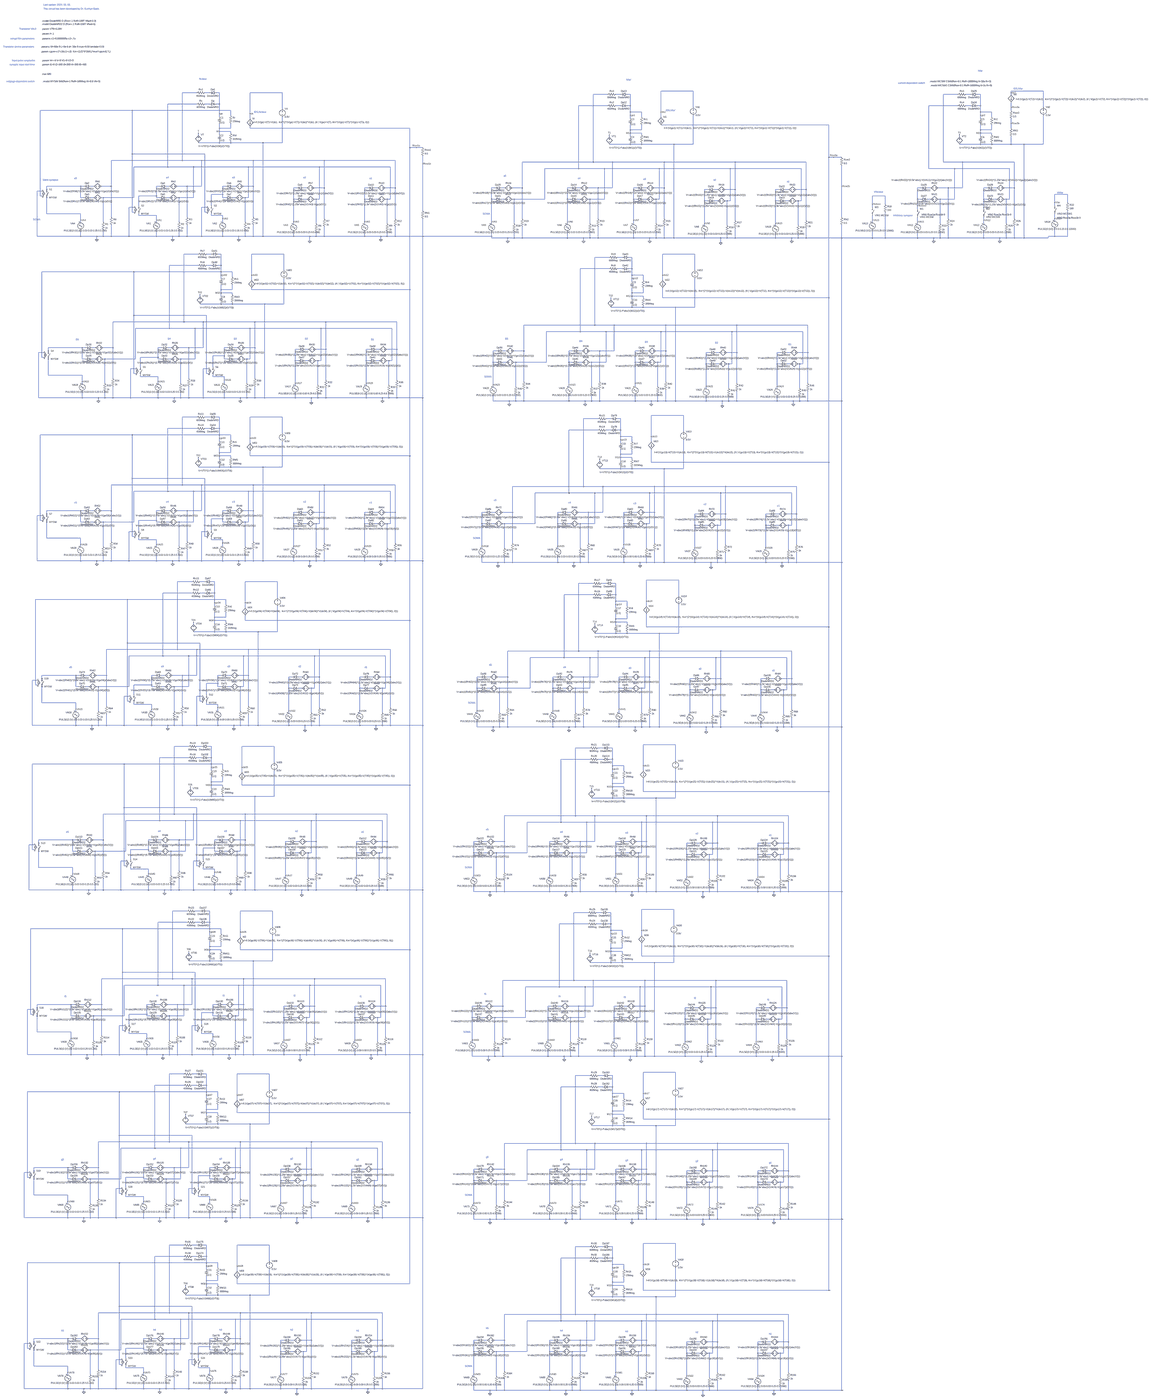
[diagram p0: schematic depth_Baek.asc, whole sheet]
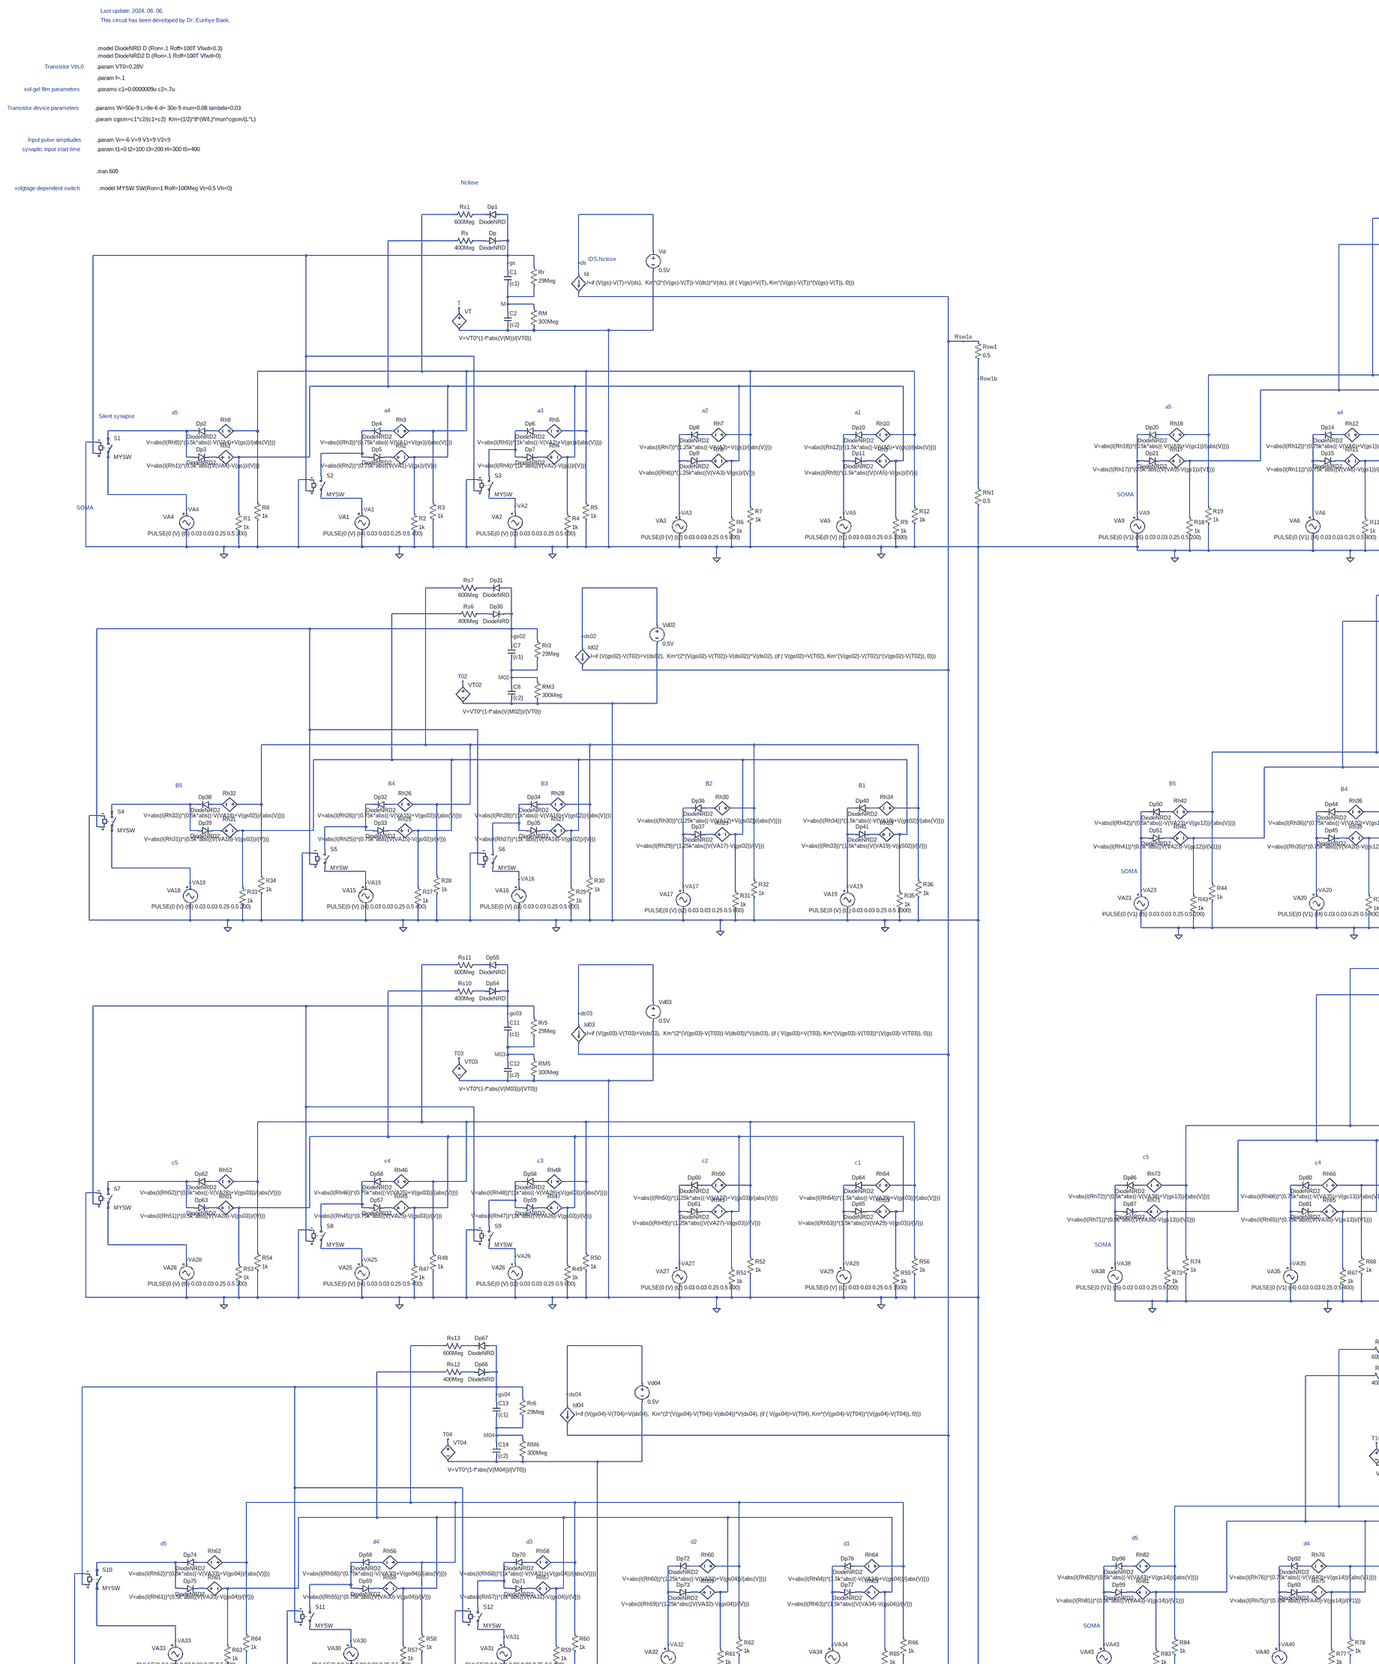
[diagram p1: schematic depth_Baek.asc, part, row 1 of 2, column 1 of 2]
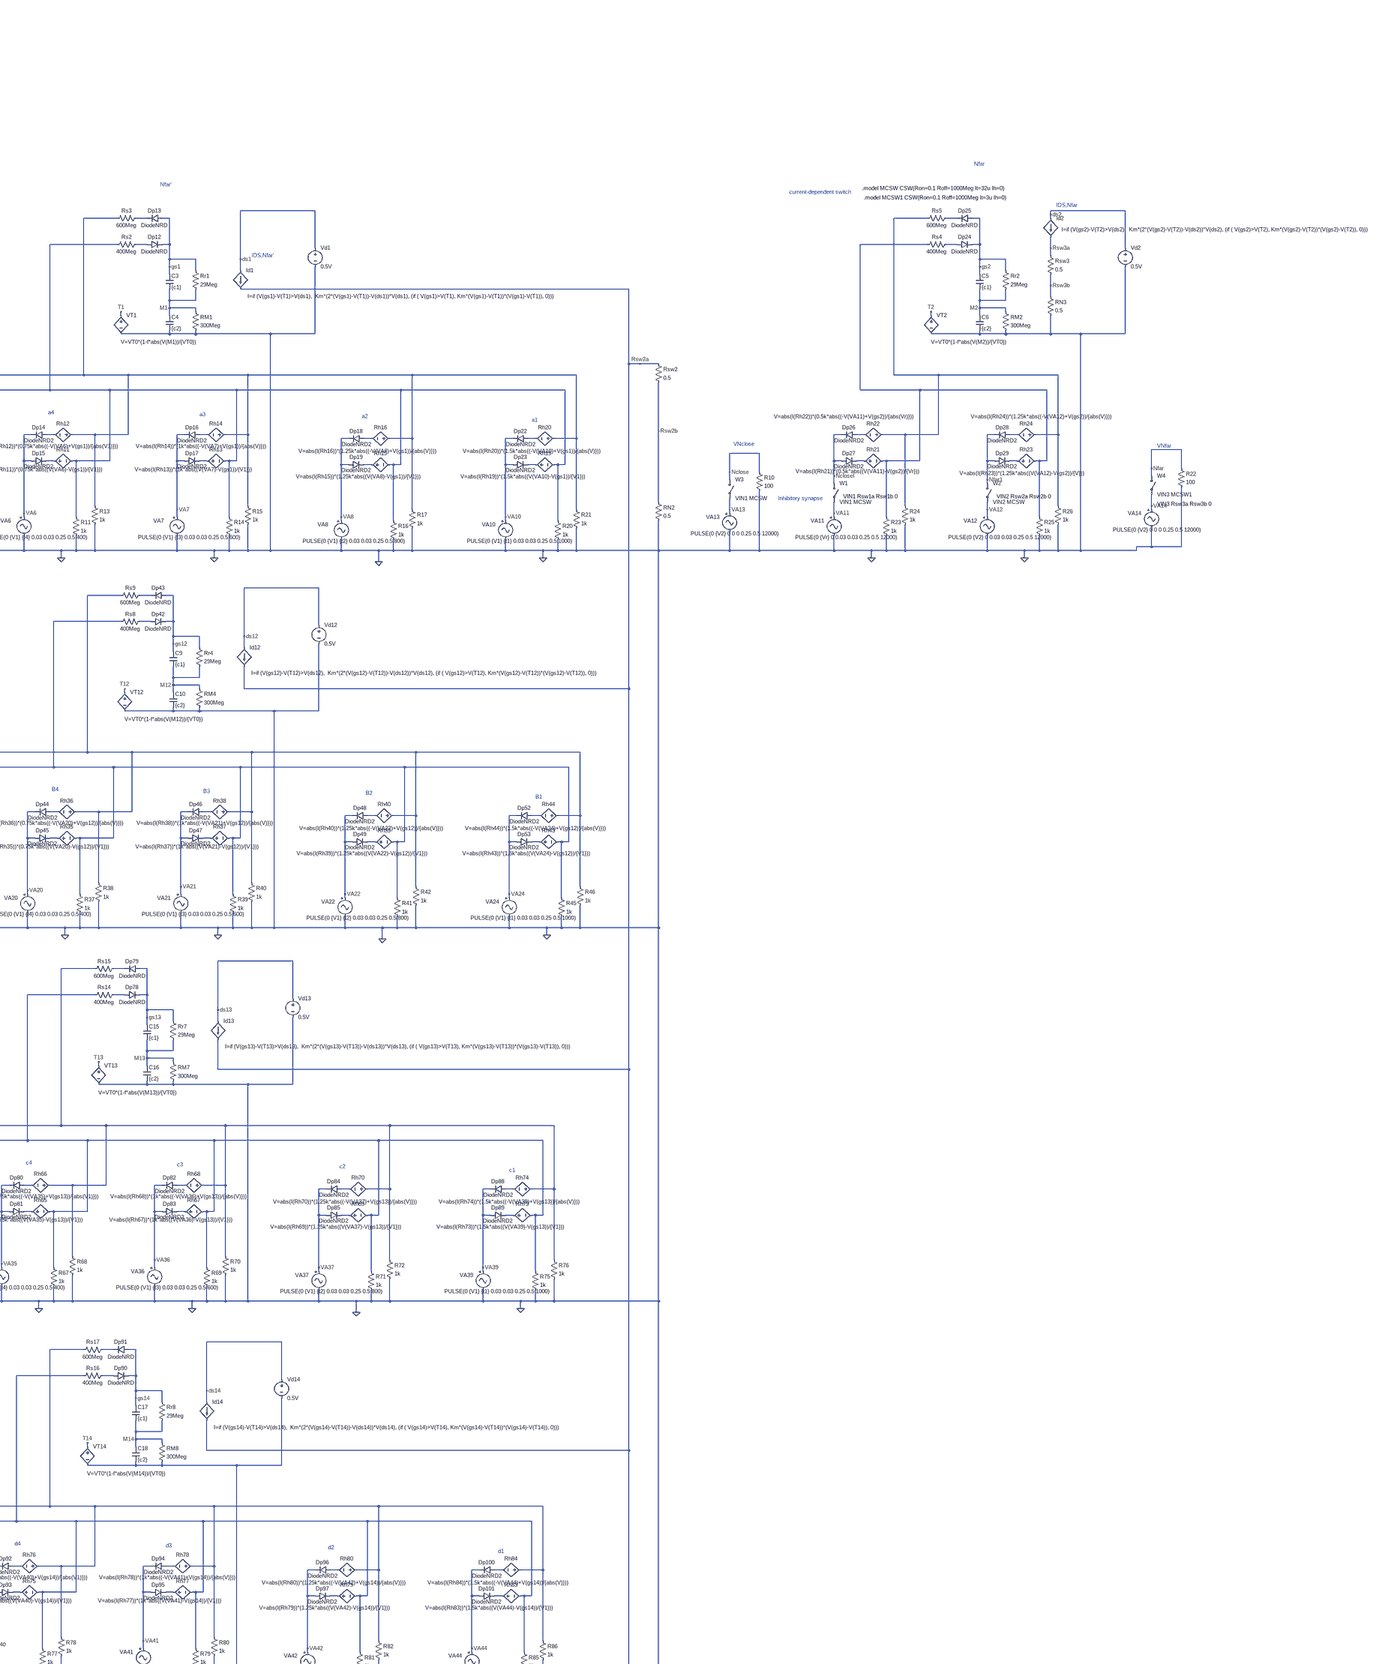
[diagram p2: schematic depth_Baek.asc, part, row 1 of 2, column 2 of 2]
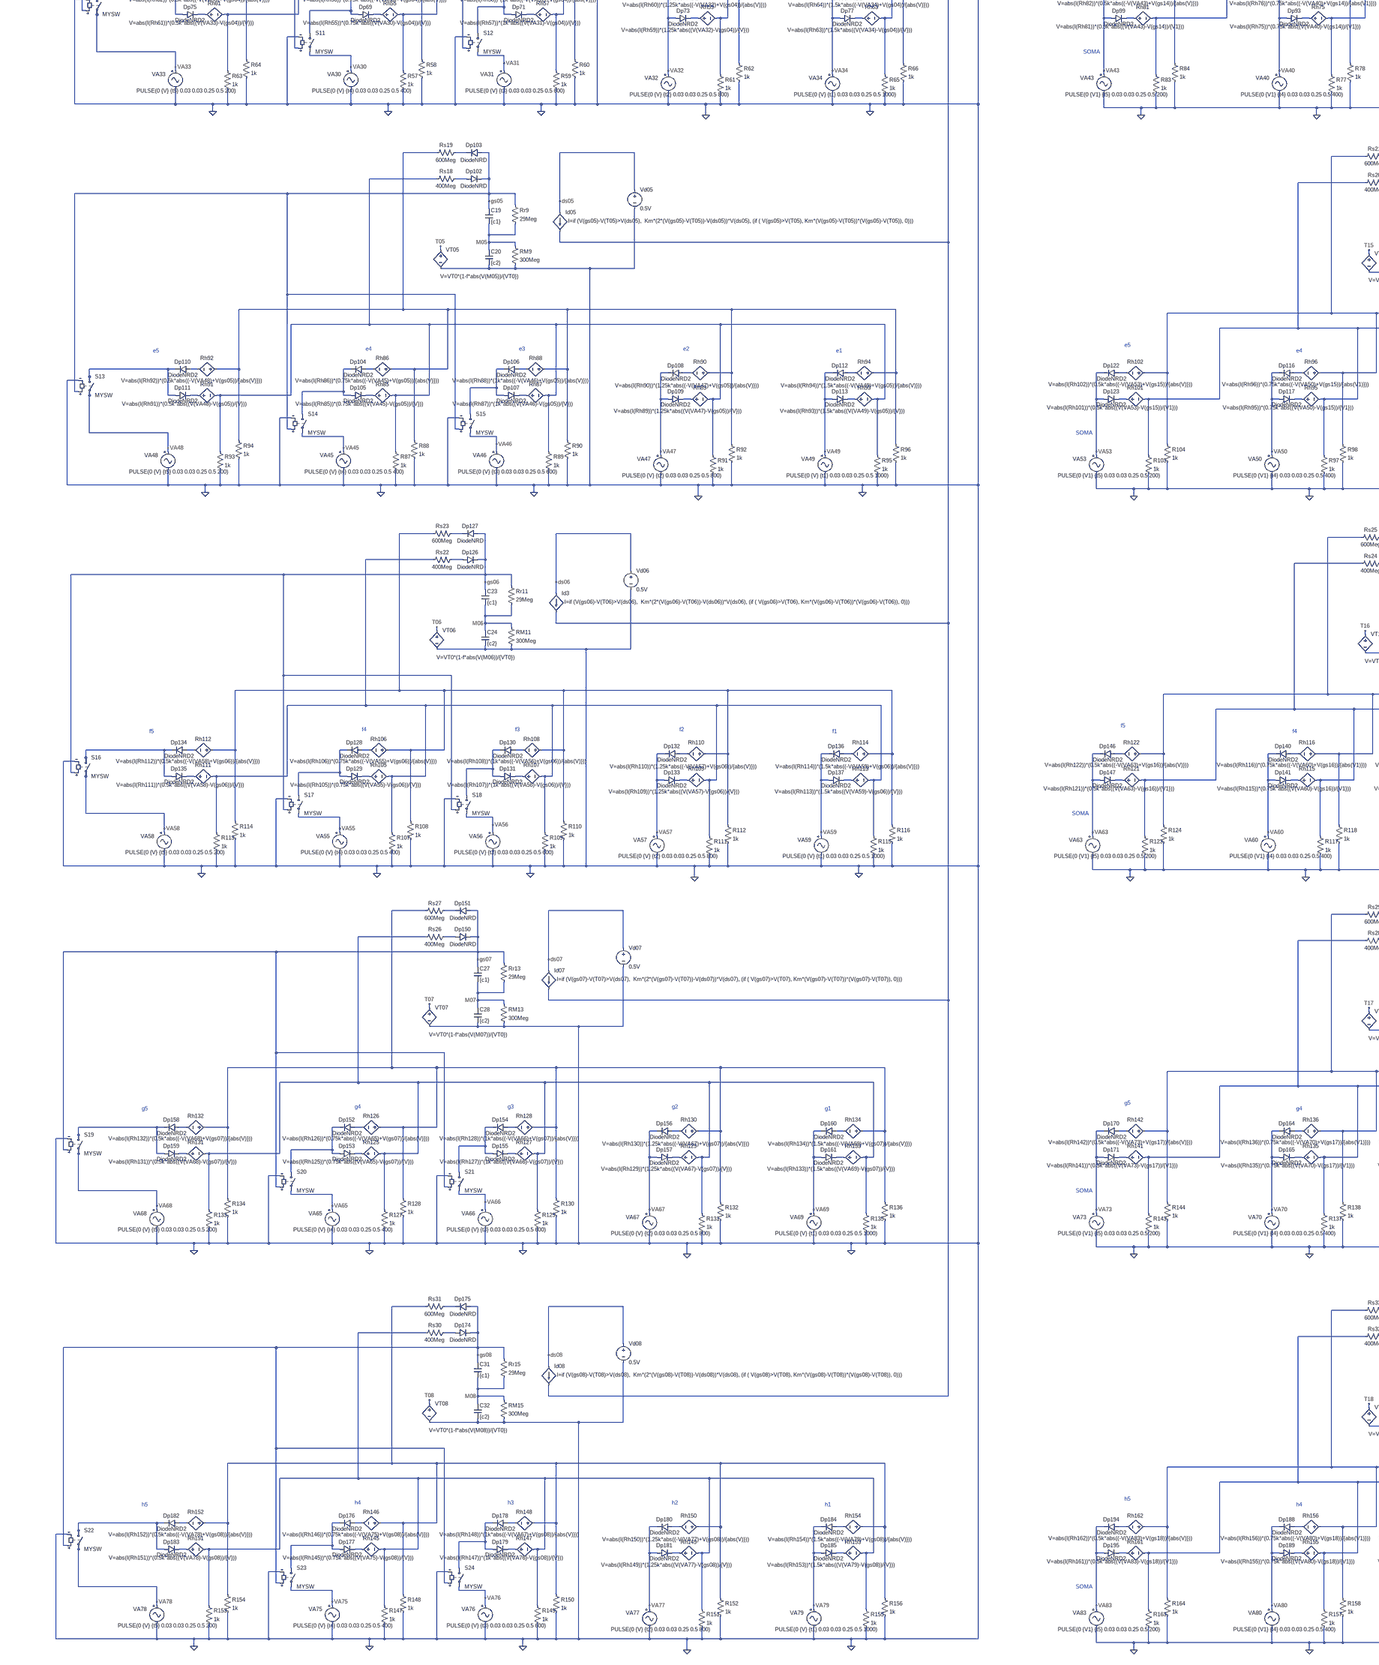
[diagram p3: schematic depth_Baek.asc, part, row 2 of 2, column 1 of 2]
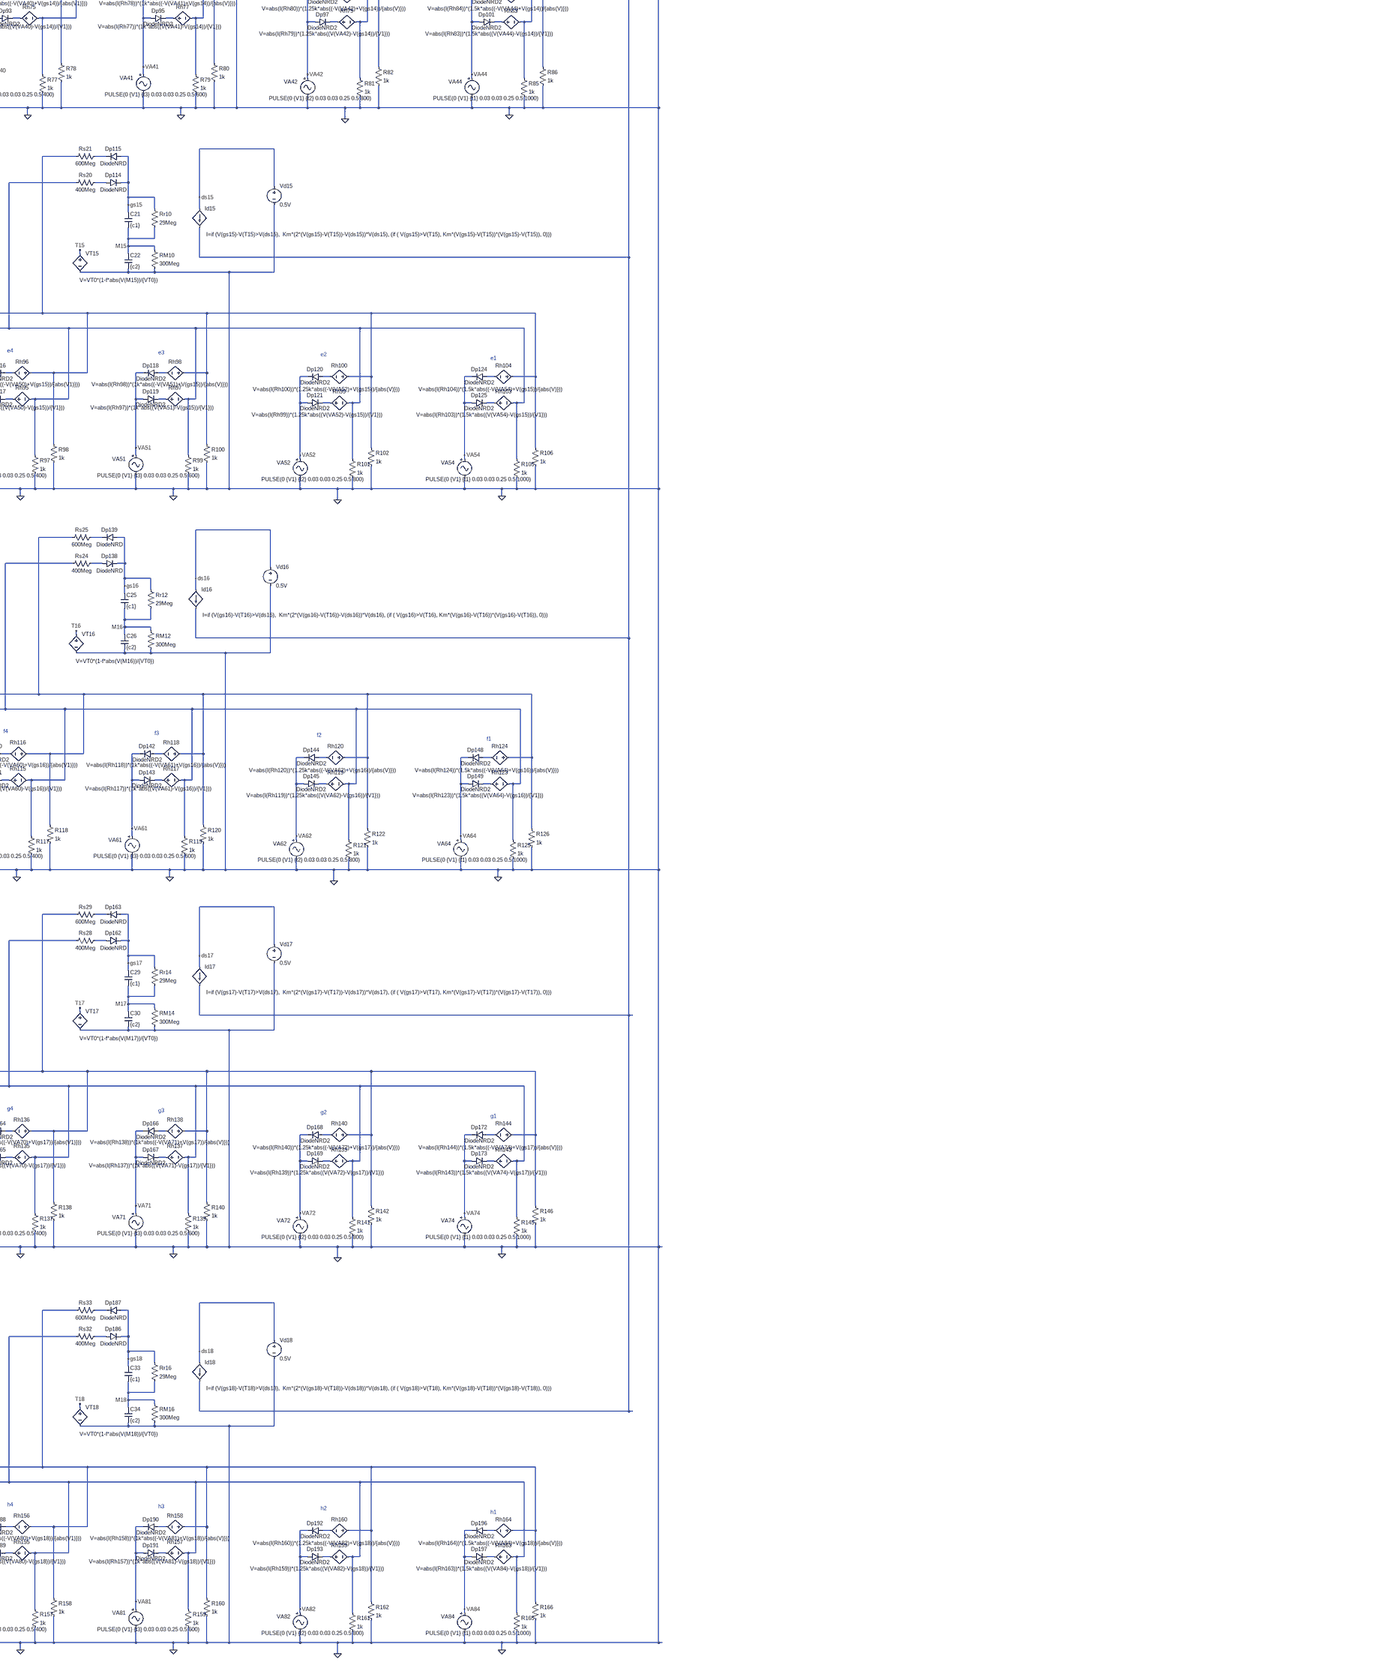
[diagram p4: schematic depth_Baek.asc, part, row 2 of 2, column 2 of 2]
* depth_Baek.asc
Vd ds 0 0.5V
B§Id ds Rsw1a I=if (V(gs)-V(T)>V(ds),  Km*(2*(V(gs)-V(T))-V(ds))*V(ds), (if ( V(gs)>V(T), Km*(V(gs)-V(T))*(V(gs)-V(T)), 0)))
C1 gs M {c1}
C2 M 0 {c2}
Dp N008 gs DiodeNRD
Rs N008 N007 400Meg
Rr gs M 29Meg
RM M 0 300Meg
B§VT T 0 V=VT0*(1-f*abs(V(M))/{VT0})
Dp1 gs N002 DiodeNRD
Rs1 N002 N001 600Meg
VA1 VA1 0 PULSE(0 {V} {t4} 0.03 0.03 0.25 0.5 400)
R2 N007 0 1k
B§Rh2 N029 N007 V=abs(I(Rh2))*(0.75k*abs((V(VA1)-V(gs))/{V}))
B§Rh3 N001 N016 V=abs(I(Rh3))*(0.75k*abs((-V(VA1)+V(gs))/{abs(V)}))
Dp4 N016 N015 DiodeNRD2
Dp5 N015 N029 DiodeNRD2
R3 N001 0 1k
VA2 VA2 0 PULSE(0 {V} {t3} 0.03 0.03 0.25 0.5 600)
R4 N007 0 1k
B§Rh4 N030 N007 V=abs(I(Rh4))*(1k*abs((V(VA2)-V(gs))/{V}))
B§Rh5 N001 N018 V=abs(I(Rh5))*(1k*abs((-V(VA2)+V(gs))/{abs(V)}))
Dp6 N018 N017 DiodeNRD2
Dp7 N017 N030 DiodeNRD2
R5 N001 0 1k
VA3 VA3 0 PULSE(0 {V} {t2} 0.03 0.03 0.25 0.5 800)
R6 N007 0 1k
B§Rh6 N031 N007 V=abs(I(Rh6))*(1.25k*abs((V(VA3)-V(gs))/{V}))
B§Rh7 N001 N019 V=abs(I(Rh7))*(1.25k*abs((-V(VA3)+V(gs))/{abs(V)}))
Dp8 N019 VA3 DiodeNRD2
Dp9 VA3 N031 DiodeNRD2
R7 N001 0 1k
VA4 VA4 0 PULSE(0 {V} {t5} 0.03 0.03 0.25 0.5 200)
R1 N007 0 1k
B§Rh1 N028 N007 V=abs(I(Rh1))*(0.5k*abs((V(VA4)-V(gs))/{V}))
B§Rh8 N001 N014 V=abs(I(Rh8))*(0.5k*abs((-V(VA4)+V(gs))/{abs(V)}))
Dp2 N014 N013 DiodeNRD2
Dp3 N013 N028 DiodeNRD2
R8 N001 0 1k
S1 N013 VA4 gs 0 MYSW
VA5 VA5 0 PULSE(0 {V} {t1} 0.03 0.03 0.25 0.5 1000)
R9 N007 0 1k
B§Rh9 N032 N007 V=abs(I(Rh9))*(1.5k*abs((V(VA5)-V(gs))/{V}))
B§Rh10 N001 N020 V=abs(I(Rh12))*(1.5k*abs((-V(VA5)+V(gs))/{abs(V)}))
Dp10 N020 VA5 DiodeNRD2
Dp11 VA5 N032 DiodeNRD2
R12 N001 0 1k
Vd1 ds1 0 0.5V
B§Id1 ds1 Rsw2a I=if (V(gs1)-V(T1)>V(ds1),  Km*(2*(V(gs1)-V(T1))-V(ds1))*V(ds1), (if ( V(gs1)>V(T1), Km*(V(gs1)-V(T1))*(V(gs1)-V(T1)), 0)))
C3 gs1 M1 {c1}
C4 M1 0 {c2}
Dp12 N010 gs1 DiodeNRD
Rs2 N010 N009 400Meg
Rr1 gs1 M1 29Meg
RM1 M1 0 300Meg
B§VT1 T1 0 V=VT0*(1-f*abs(V(M1))/{VT0})
Dp13 gs1 N004 DiodeNRD
Rs3 N004 N003 600Meg
VA6 VA6 0 PULSE(0 {V1} {t4} 0.03 0.03 0.25 0.5 400)
R11 N009 0 1k
B§Rh11 N034 N009 V=abs(I(Rh11))*(0.75k*abs((V(VA6)-V(gs1))/{V1}))
B§Rh12 N003 N022 V=abs(I(Rh12))*(0.75k*abs((-V(VA6)+V(gs1))/{abs(V1)}))
Dp14 N022 VA6 DiodeNRD2
Dp15 VA6 N034 DiodeNRD2
R13 N003 0 1k
VA7 VA7 0 PULSE(0 {V1} {t3} 0.03 0.03 0.25 0.5 600)
R14 N009 0 1k
B§Rh13 N035 N009 V=abs(I(Rh13))*(1k*abs((V(VA7)-V(gs1))/{V1}))
B§Rh14 N003 N023 V=abs(I(Rh14))*(1k*abs((-V(VA7)+V(gs1))/{abs(V)}))
Dp16 N023 VA7 DiodeNRD2
Dp17 VA7 N035 DiodeNRD2
R15 N003 0 1k
VA8 VA8 0 PULSE(0 {V1} {t2} 0.03 0.03 0.25 0.5 800)
R16 N009 0 1k
B§Rh15 N038 N009 V=abs(I(Rh15))*(1.25k*abs((V(VA8)-V(gs1))/{V1}))
B§Rh16 N003 N026 V=abs(I(Rh16))*(1.25k*abs((-V(VA8)+V(gs1))/{abs(V)}))
Dp18 N026 VA8 DiodeNRD2
Dp19 VA8 N038 DiodeNRD2
R17 N003 0 1k
VA9 VA9 0 PULSE(0 {V1} {t5} 0.03 0.03 0.25 0.5 200)
R18 N009 0 1k
B§Rh17 N033 N009 V=abs(I(Rh17))*(0.5k*abs((V(VA9)-V(gs1))/{V1}))
B§Rh18 N003 N021 V=abs(I(Rh18))*(0.5k*abs((-V(VA9)+V(gs1))/{abs(V)}))
Dp20 N021 VA9 DiodeNRD2
Dp21 VA9 N033 DiodeNRD2
R19 N003 0 1k
VA10 VA10 0 PULSE(0 {V1} {t1} 0.03 0.03 0.25 0.5 1000)
R20 N009 0 1k
B§Rh19 N039 N009 V=abs(I(Rh19))*(1.5k*abs((V(VA10)-V(gs1))/{V1}))
B§Rh20 N003 N027 V=abs(I(Rh20))*(1.5k*abs((-V(VA10)+V(gs1))/{abs(V)}))
Dp22 N027 VA10 DiodeNRD2
Dp23 VA10 N039 DiodeNRD2
R21 N003 0 1k
W2 Nfar1 VA12 VIN2 MCSW
Vd2 ds2 0 0.5V
B§Id2 ds2 Rsw3a I=if (V(gs2)-V(T2)>V(ds2),  Km*(2*(V(gs2)-V(T2))-V(ds2))*V(ds2), (if ( V(gs2)>V(T2), Km*(V(gs2)-V(T2))*(V(gs2)-V(T2)), 0)))
C5 gs2 M2 {c1}
C6 M2 0 {c2}
Dp24 N012 gs2 DiodeNRD
Rs4 N012 N011 400Meg
Rr2 gs2 M2 29Meg
RM2 M2 0 300Meg
B§VT2 T2 0 V=VT0*(1-f*abs(V(M2))/{VT0})
Dp25 gs2 N006 DiodeNRD
Rs5 N006 N005 600Meg
VA11 VA11 0 PULSE(0 {Vr} 0 0.03 0.03 0.25 0.5 12000)
R23 N011 0 1k
B§Rh21 N036 N011 V=abs(I(Rh21))*(0.5k*abs((V(VA11)-V(gs2))/{Vr}))
B§Rh22 N005 N024 V=abs(I(Rh22))*(0.5k*abs((-V(VA11)+V(gs2))/{abs(Vr)}))
Dp26 N024 NcloseI DiodeNRD2
Dp27 NcloseI N036 DiodeNRD2
R24 N005 0 1k
VA12 VA12 0 PULSE(0 {V2} 0 0.03 0.03 0.25 0.5 12000)
R25 N011 0 1k
B§Rh23 N037 N011 V=abs(I(Rh23))*(1.25k*abs((V(VA12)-V(gs2))/{V}))
B§Rh24 N005 N025 V=abs(I(Rh24))*(1.25k*abs((-V(VA12)+V(gs2))/{abs(V)}))
Dp28 N025 Nfar1 DiodeNRD2
Dp29 Nfar1 N037 DiodeNRD2
R26 N005 0 1k
W1 NcloseI VA11 VIN1 MCSW
Rsw3 Rsw3a Rsw3b 0.5
Rsw1 Rsw1a Rsw1b 0.5
Rsw2 Rsw2a Rsw2b 0.5
RN1 Rsw1b 0 0.5
RN2 Rsw2b 0 0.5
RN3 Rsw3b 0 0.5
VA13 VA13 0 PULSE(0 {V2} 0 0 0 0.25 0.5 12000)
W3 Nclose VA13 VIN1 MCSW
R10 Nclose 0 100
VA14 VA14 0 PULSE(0 {V2} 0 0 0 0.25 0.5 12000)
W4 Nfar VA14 VIN3 MCSW1
R22 Nfar 0 100
S2 N015 VA1 gs 0 MYSW
S3 N017 VA2 gs 0 MYSW
Vd02 ds02 0 0.5V
B§Id02 ds02 Rsw1a I=if (V(gs02)-V(T02)>V(ds02),  Km*(2*(V(gs02)-V(T02))-V(ds02))*V(ds02), (if ( V(gs02)>V(T02), Km*(V(gs02)-V(T02))*(V(gs02)-V(T02)), 0)))
C7 gs02 M02 {c1}
C8 M02 0 {c2}
Dp30 N045 gs02 DiodeNRD
Rs6 N045 N044 400Meg
Rr3 gs02 M02 29Meg
RM3 M02 0 300Meg
B§VT02 T02 0 V=VT0*(1-f*abs(V(M02))/{VT0})
Dp31 gs02 N041 DiodeNRD
Rs7 N041 N040 600Meg
VA15 VA15 0 PULSE(0 {V} {t4} 0.03 0.03 0.25 0.5 400)
R27 N044 0 1k
B§Rh25 N062 N044 V=abs(I(Rh25))*(0.75k*abs((V(VA15)-V(gs02))/{V}))
B§Rh26 N040 N051 V=abs(I(Rh26))*(0.75k*abs((-V(VA15)+V(gs02))/{abs(V)}))
Dp32 N051 N050 DiodeNRD2
Dp33 N050 N062 DiodeNRD2
R28 N040 0 1k
VA16 VA16 0 PULSE(0 {V} {t3} 0.03 0.03 0.25 0.5 600)
R29 N044 0 1k
B§Rh27 N063 N044 V=abs(I(Rh27))*(1k*abs((V(VA16)-V(gs02))/{V}))
B§Rh28 N040 N053 V=abs(I(Rh28))*(1k*abs((-V(VA16)+V(gs02))/{abs(V)}))
Dp34 N053 N052 DiodeNRD2
Dp35 N052 N063 DiodeNRD2
R30 N040 0 1k
VA17 VA17 0 PULSE(0 {V} {t2} 0.03 0.03 0.25 0.5 800)
R31 N044 0 1k
B§Rh29 N064 N044 V=abs(I(Rh29))*(1.25k*abs((V(VA17)-V(gs02))/{V}))
B§Rh30 N040 N054 V=abs(I(Rh30))*(1.25k*abs((-V(VA17)+V(gs02))/{abs(V)}))
Dp36 N054 VA17 DiodeNRD2
Dp37 VA17 N064 DiodeNRD2
R32 N040 0 1k
VA18 VA18 0 PULSE(0 {V} {t5} 0.03 0.03 0.25 0.5 200)
R33 N044 0 1k
B§Rh31 N061 N044 V=abs(I(Rh31))*(0.5k*abs((V(VA18)-V(gs02))/{V}))
B§Rh32 N040 N049 V=abs(I(Rh32))*(0.5k*abs((-V(VA18)+V(gs02))/{abs(V)}))
Dp38 N049 N048 DiodeNRD2
Dp39 N048 N061 DiodeNRD2
R34 N040 0 1k
S4 N048 VA18 gs02 0 MYSW
VA19 VA19 0 PULSE(0 {V} {t1} 0.03 0.03 0.25 0.5 1000)
R35 N044 0 1k
B§Rh33 N065 N044 V=abs(I(Rh33))*(1.5k*abs((V(VA19)-V(gS02))/{V}))
B§Rh34 N040 N055 V=abs(I(Rh34))*(1.5k*abs((-V(VA19)+V(gs02))/{abs(V)}))
Dp40 N055 VA19 DiodeNRD2
Dp41 VA19 N065 DiodeNRD2
R36 N040 0 1k
S5 N050 VA15 gs02 0 MYSW
S6 N052 VA16 gs02 0 MYSW
Vd12 ds12 0 0.5V
B§Id12 ds12 Rsw2a I=if (V(gs12)-V(T12)>V(ds12),  Km*(2*(V(gs12)-V(T12))-V(ds12))*V(ds12), (if ( V(gs12)>V(T12), Km*(V(gs12)-V(T12))*(V(gs12)-V(T12)), 0)))
C9 gs12 M12 {c1}
C10 M12 0 {c2}
Dp42 N047 gs12 DiodeNRD
Rs8 N047 N046 400Meg
Rr4 gs12 M12 29Meg
RM4 M12 0 300Meg
B§VT12 T12 0 V=VT0*(1-f*abs(V(M12))/{VT0})
Dp43 gs12 N043 DiodeNRD
Rs9 N043 N042 600Meg
VA20 VA20 0 PULSE(0 {V1} {t4} 0.03 0.03 0.25 0.5 400)
R37 N046 0 1k
B§Rh35 N067 N046 V=abs(I(Rh35))*(0.75k*abs((V(VA20)-V(gs12))/{V1}))
B§Rh36 N042 N057 V=abs(I(Rh36))*(0.75k*abs((-V(VA20)+V(gs12))/{abs(V)}))
Dp44 N057 VA20 DiodeNRD2
Dp45 VA20 N067 DiodeNRD2
R38 N042 0 1k
VA21 VA21 0 PULSE(0 {V1} {t3} 0.03 0.03 0.25 0.5 600)
R39 N046 0 1k
B§Rh37 N068 N046 V=abs(I(Rh37))*(1k*abs((V(VA21)-V(gs12))/{V1}))
B§Rh38 N042 N058 V=abs(I(Rh38))*(1k*abs((-V(VA21)+V(gs12))/{abs(V)}))
Dp46 N058 VA21 DiodeNRD2
Dp47 VA21 N068 DiodeNRD2
R40 N042 0 1k
VA22 VA22 0 PULSE(0 {V1} {t2} 0.03 0.03 0.25 0.5 800)
R41 N046 0 1k
B§Rh39 N069 N046 V=abs(I(Rh39))*(1.25k*abs((V(VA22)-V(gs12))/{V1}))
B§Rh40 N042 N059 V=abs(I(Rh40))*(1.25k*abs((-V(VA22)+V(gs12))/{abs(V)}))
Dp48 N059 VA22 DiodeNRD2
Dp49 VA22 N069 DiodeNRD2
R42 N042 0 1k
VA23 VA23 0 PULSE(0 {V1} {t5} 0.03 0.03 0.25 0.5 200)
R43 N046 0 1k
B§Rh41 N066 N046 V=abs(I(Rh41))*(0.5k*abs((V(VA23)-V(gs12))/{V1}))
B§Rh42 N042 N056 V=abs(I(Rh42))*(0.5k*abs((-V(VA23)+V(gs12))/{abs(V)}))
Dp50 N056 VA23 DiodeNRD2
Dp51 VA23 N066 DiodeNRD2
R44 N042 0 1k
VA24 VA24 0 PULSE(0 {V1} {t1} 0.03 0.03 0.25 0.5 1000)
R45 N046 0 1k
B§Rh43 N070 N046 V=abs(I(Rh43))*(1.5k*abs((V(VA24)-V(gs12))/{V1}))
B§Rh44 N042 N060 V=abs(I(Rh44))*(1.5k*abs((-V(VA24)+V(gs12))/{abs(V)}))
Dp52 N060 VA24 DiodeNRD2
Dp53 VA24 N070 DiodeNRD2
R46 N042 0 1k
Vd03 ds03 0 0.5V
B§Id03 ds03 Rsw1a I=if (V(gs03)-V(T03)>V(ds03),  Km*(2*(V(gs03)-V(T03))-V(ds03))*V(ds03), (if ( V(gs03)>V(T03), Km*(V(gs03)-V(T03))*(V(gs03)-V(T03)), 0)))
C11 gs03 M03 {c1}
C12 M03 0 {c2}
Dp54 N076 gs03 DiodeNRD
Rs10 N076 N075 400Meg
Rr5 gs03 M03 29Meg
RM5 M03 0 300Meg
B§VT03 T03 0 V=VT0*(1-f*abs(V(M03))/{VT0})
Dp55 gs03 N072 DiodeNRD
Rs11 N072 N071 600Meg
VA25 VA25 0 PULSE(0 {V} {t4} 0.03 0.03 0.25 0.5 400)
R47 N075 0 1k
B§Rh45 N093 N075 V=abs(I(Rh45))*(0.75k*abs((V(VA25)-V(gs03))/{V}))
B§Rh46 N071 N082 V=abs(I(Rh46))*(0.75k*abs((-V(VA25)+V(gs03))/{abs(V)}))
Dp56 N082 N081 DiodeNRD2
Dp57 N081 N093 DiodeNRD2
R48 N071 0 1k
VA26 VA26 0 PULSE(0 {V} {t3} 0.03 0.03 0.25 0.5 600)
R49 N075 0 1k
B§Rh47 N094 N075 V=abs(I(Rh47))*(1k*abs((V(VA26)-V(gs03))/{V}))
B§Rh48 N071 N084 V=abs(I(Rh48))*(1k*abs((-V(VA26)+V(gs03))/{abs(V)}))
Dp58 N084 N083 DiodeNRD2
Dp59 N083 N094 DiodeNRD2
R50 N071 0 1k
VA27 VA27 0 PULSE(0 {V} {t2} 0.03 0.03 0.25 0.5 800)
R51 N075 0 1k
B§Rh49 N095 N075 V=abs(I(Rh49))*(1.25k*abs((V(VA27)-V(gs03))/{V}))
B§Rh50 N071 N085 V=abs(I(Rh50))*(1.25k*abs((-V(VA27)+V(gs03))/{abs(V)}))
Dp60 N085 VA27 DiodeNRD2
Dp61 VA27 N095 DiodeNRD2
R52 N071 0 1k
VA28 VA28 0 PULSE(0 {V} {t5} 0.03 0.03 0.25 0.5 200)
R53 N075 0 1k
B§Rh51 N092 N075 V=abs(I(Rh51))*(0.5k*abs((V(VA28)-V(gs03))/{V}))
B§Rh52 N071 N080 V=abs(I(Rh52))*(0.5k*abs((-V(VA28)+V(gs03))/{abs(V)}))
Dp62 N080 N079 DiodeNRD2
Dp63 N079 N092 DiodeNRD2
R54 N071 0 1k
S7 N079 VA28 gs03 0 MYSW
VA29 VA29 0 PULSE(0 {V} {t1} 0.03 0.03 0.25 0.5 1000)
R55 N075 0 1k
B§Rh53 N096 N075 V=abs(I(Rh53))*(1.5k*abs((V(VA29)-V(gs03))/{V}))
B§Rh54 N071 N086 V=abs(I(Rh54))*(1.5k*abs((-V(VA29)+V(gs03))/{abs(V)}))
Dp64 N086 VA29 DiodeNRD2
Dp65 VA29 N096 DiodeNRD2
R56 N071 0 1k
S8 N081 VA25 gs03 0 MYSW
S9 N083 VA26 gs03 0 MYSW
Vd13 ds13 0 0.5V
B§Id13 ds13 Rsw2a I=if (V(gs13)-V(T13)>V(ds13),  Km*(2*(V(gs13)-V(T13))-V(ds13))*V(ds13), (if ( V(gs13)>V(T13), Km*(V(gs13)-V(T13))*(V(gs13)-V(T13)), 0)))
C15 gs13 M13 {c1}
C16 M13 0 {c2}
Dp78 N078 gs13 DiodeNRD
Rs14 N078 N077 400Meg
Rr7 gs13 M13 29Meg
RM7 M13 0 300Meg
B§VT13 T13 0 V=VT0*(1-f*abs(V(M13))/{VT0})
Dp79 gs13 N074 DiodeNRD
Rs15 N074 N073 600Meg
VA35 VA35 0 PULSE(0 {V1} {t4} 0.03 0.03 0.25 0.5 400)
R67 N077 0 1k
B§Rh65 N098 N077 V=abs(I(Rh65))*(0.75k*abs((V(VA35)-V(gs13))/{V1}))
B§Rh66 N073 N088 V=abs(I(Rh66))*(0.75k*abs((-V(VA35)+V(gs13))/{abs(V1)}))
Dp80 N088 VA35 DiodeNRD2
Dp81 VA35 N098 DiodeNRD2
R68 N073 0 1k
VA36 VA36 0 PULSE(0 {V1} {t3} 0.03 0.03 0.25 0.5 600)
R69 N077 0 1k
B§Rh67 N099 N077 V=abs(I(Rh67))*(1k*abs((V(VA36)-V(gs13))/{V1}))
B§Rh68 N073 N089 V=abs(I(Rh68))*(1k*abs((-V(VA36)+V(gs13))/{abs(V)}))
Dp82 N089 VA36 DiodeNRD2
Dp83 VA36 N099 DiodeNRD2
R70 N073 0 1k
VA37 VA37 0 PULSE(0 {V1} {t2} 0.03 0.03 0.25 0.5 800)
R71 N077 0 1k
B§Rh69 N100 N077 V=abs(I(Rh69))*(1.25k*abs((V(VA37)-V(gs13))/{V1}))
B§Rh70 N073 N090 V=abs(I(Rh70))*(1.25k*abs((-V(VA37)+V(gs13))/{abs(V)}))
Dp84 N090 VA37 DiodeNRD2
Dp85 VA37 N100 DiodeNRD2
R72 N073 0 1k
VA38 VA38 0 PULSE(0 {V1} {t5} 0.03 0.03 0.25 0.5 200)
R73 N077 0 1k
B§Rh71 N097 N077 V=abs(I(Rh71))*(0.5k*abs((V(VA38)-V(gs13))/{V1}))
B§Rh72 N073 N087 V=abs(I(Rh72))*(0.5k*abs((-V(VA38)+V(gs13))/{abs(V)}))
Dp86 N087 VA38 DiodeNRD2
Dp87 VA38 N097 DiodeNRD2
R74 N073 0 1k
VA39 VA39 0 PULSE(0 {V1} {t1} 0.03 0.03 0.25 0.5 1000)
R75 N077 0 1k
B§Rh73 N101 N077 V=abs(I(Rh73))*(1.5k*abs((V(VA39)-V(gs13))/{V1}))
B§Rh74 N073 N091 V=abs(I(Rh74))*(1.5k*abs((-V(VA39)+V(gs13))/{abs(V)}))
Dp88 N091 VA39 DiodeNRD2
Dp89 VA39 N101 DiodeNRD2
R76 N073 0 1k
Vd04 ds04 0 0.5V
B§Id04 ds04 Rsw1a I=if (V(gs04)-V(T04)>V(ds04),  Km*(2*(V(gs04)-V(T04))-V(ds04))*V(ds04), (if ( V(gs04)>V(T04), Km*(V(gs04)-V(T04))*(V(gs04)-V(T04)), 0)))
C13 gs04 M04 {c1}
C14 M04 0 {c2}
Dp66 N107 gs04 DiodeNRD
Rs12 N107 N106 400Meg
Rr6 gs04 M04 29Meg
RM6 M04 0 300Meg
B§VT04 T04 0 V=VT0*(1-f*abs(V(M04))/{VT0})
Dp67 gs04 N103 DiodeNRD
Rs13 N103 N102 600Meg
VA30 VA30 0 PULSE(0 {V} {t4} 0.03 0.03 0.25 0.5 400)
R57 N106 0 1k
B§Rh55 N124 N106 V=abs(I(Rh55))*(0.75k*abs((V(VA30)-V(gs04))/{V}))
B§Rh56 N102 N113 V=abs(I(Rh56))*(0.75k*abs((-V(VA30)+V(gs04))/{abs(V)}))
Dp68 N113 N112 DiodeNRD2
Dp69 N112 N124 DiodeNRD2
R58 N102 0 1k
VA31 VA31 0 PULSE(0 {V} {t3} 0.03 0.03 0.25 0.5 600)
R59 N106 0 1k
B§Rh57 N125 N106 V=abs(I(Rh57))*(1k*abs((V(VA31)-V(gs04))/{V}))
B§Rh58 N102 N115 V=abs(I(Rh58))*(1k*abs((-V(VA31)+V(gs04))/{abs(V)}))
Dp70 N115 N114 DiodeNRD2
Dp71 N114 N125 DiodeNRD2
R60 N102 0 1k
VA32 VA32 0 PULSE(0 {V} {t2} 0.03 0.03 0.25 0.5 800)
R61 N106 0 1k
B§Rh59 N126 N106 V=abs(I(Rh59))*(1.25k*abs((V(VA32)-V(gs04))/{V}))
B§Rh60 N102 N116 V=abs(I(Rh60))*(1.25k*abs((-V(VA32)+V(gs04))/{abs(V)}))
Dp72 N116 VA32 DiodeNRD2
Dp73 VA32 N126 DiodeNRD2
R62 N102 0 1k
VA33 VA33 0 PULSE(0 {V} {t5} 0.03 0.03 0.25 0.5 200)
R63 N106 0 1k
B§Rh61 N123 N106 V=abs(I(Rh61))*(0.5k*abs((V(VA33)-V(gs04))/{V}))
B§Rh62 N102 N111 V=abs(I(Rh62))*(0.5k*abs((-V(VA33)+V(gs04))/{abs(V)}))
Dp74 N111 N110 DiodeNRD2
Dp75 N110 N123 DiodeNRD2
R64 N102 0 1k
S10 N110 VA33 gs04 0 MYSW
VA34 VA34 0 PULSE(0 {V} {t1} 0.03 0.03 0.25 0.5 1000)
R65 N106 0 1k
B§Rh63 N127 N106 V=abs(I(Rh63))*(1.5k*abs((V(VA34)-V(gs04))/{V}))
B§Rh64 N102 N117 V=abs(I(Rh64))*(1.5k*abs((-V(VA34)+V(gs04))/{abs(V)}))
Dp76 N117 VA34 DiodeNRD2
Dp77 VA34 N127 DiodeNRD2
R66 N102 0 1k
S11 N112 VA30 gs04 0 MYSW
S12 N114 VA31 gs04 0 MYSW
Vd14 ds14 0 0.5V
B§Id14 ds14 Rsw2a I=if (V(gs14)-V(T14)>V(ds14),  Km*(2*(V(gs14)-V(T14))-V(ds14))*V(ds14), (if ( V(gs14)>V(T14), Km*(V(gs14)-V(T14))*(V(gs14)-V(T14)), 0)))
C17 gs14 M14 {c1}
C18 M14 0 {c2}
Dp90 N109 gs14 DiodeNRD
Rs16 N109 N108 400Meg
Rr8 gs14 M14 29Meg
RM8 M14 0 300Meg
B§VT14 T14 0 V=VT0*(1-f*abs(V(M14))/{VT0})
Dp91 gs14 N105 DiodeNRD
Rs17 N105 N104 600Meg
VA40 VA40 0 PULSE(0 {V1} {t4} 0.03 0.03 0.25 0.5 400)
R77 N108 0 1k
B§Rh75 N129 N108 V=abs(I(Rh75))*(0.75k*abs((V(VA40)-V(gs14))/{V1}))
B§Rh76 N104 N119 V=abs(I(Rh76))*(0.75k*abs((-V(VA40)+V(gs14))/{abs(V1)}))
Dp92 N119 VA40 DiodeNRD2
Dp93 VA40 N129 DiodeNRD2
R78 N104 0 1k
VA41 VA41 0 PULSE(0 {V1} {t3} 0.03 0.03 0.25 0.5 600)
R79 N108 0 1k
B§Rh77 N130 N108 V=abs(I(Rh77))*(1k*abs((V(VA41)-V(gs14))/{V1}))
B§Rh78 N104 N120 V=abs(I(Rh78))*(1k*abs((-V(VA41)+V(gs14))/{abs(V)}))
Dp94 N120 VA41 DiodeNRD2
Dp95 VA41 N130 DiodeNRD2
R80 N104 0 1k
VA42 VA42 0 PULSE(0 {V1} {t2} 0.03 0.03 0.25 0.5 800)
R81 N108 0 1k
B§Rh79 N131 N108 V=abs(I(Rh79))*(1.25k*abs((V(VA42)-V(gs14))/{V1}))
B§Rh80 N104 N121 V=abs(I(Rh80))*(1.25k*abs((-V(VA42)+V(gs14))/{abs(V)}))
Dp96 N121 VA42 DiodeNRD2
Dp97 VA42 N131 DiodeNRD2
R82 N104 0 1k
VA43 VA43 0 PULSE(0 {V1} {t5} 0.03 0.03 0.25 0.5 200)
R83 N108 0 1k
B§Rh81 N128 N108 V=abs(I(Rh81))*(0.5k*abs((V(VA43)-V(gs14))/{V1}))
B§Rh82 N104 N118 V=abs(I(Rh82))*(0.5k*abs((-V(VA43)+V(gs14))/{abs(V)}))
Dp98 N118 VA43 DiodeNRD2
Dp99 VA43 N128 DiodeNRD2
R84 N104 0 1k
VA44 VA44 0 PULSE(0 {V1} {t1} 0.03 0.03 0.25 0.5 1000)
R85 N108 0 1k
B§Rh83 N132 N108 V=abs(I(Rh83))*(1.5k*abs((V(VA44)-V(gs14))/{V1}))
B§Rh84 N104 N122 V=abs(I(Rh84))*(1.5k*abs((-V(VA44)+V(gs14))/{abs(V)}))
Dp100 N122 VA44 DiodeNRD2
Dp101 VA44 N132 DiodeNRD2
R86 N104 0 1k
Vd05 ds05 0 0.5V
B§Id05 ds05 Rsw1a I=if (V(gs05)-V(T05)>V(ds05),  Km*(2*(V(gs05)-V(T05))-V(ds05))*V(ds05), (if ( V(gs05)>V(T05), Km*(V(gs05)-V(T05))*(V(gs05)-V(T05)), 0)))
C19 gs05 M05 {c1}
C20 M05 0 {c2}
Dp102 N138 gs05 DiodeNRD
Rs18 N138 N137 400Meg
Rr9 gs05 M05 29Meg
RM9 M05 0 300Meg
B§VT05 T05 0 V=VT0*(1-f*abs(V(M05))/{VT0})
Dp103 gs05 N134 DiodeNRD
Rs19 N134 N133 600Meg
VA45 VA45 0 PULSE(0 {V} {t4} 0.03 0.03 0.25 0.5 400)
R87 N137 0 1k
B§Rh85 N155 N137 V=abs(I(Rh85))*(0.75k*abs((V(VA45)-V(gs05))/{V}))
B§Rh86 N133 N144 V=abs(I(Rh86))*(0.75k*abs((-V(VA45)+V(gs05))/{abs(V)}))
Dp104 N144 N143 DiodeNRD2
Dp105 N143 N155 DiodeNRD2
R88 N133 0 1k
VA46 VA46 0 PULSE(0 {V} {t3} 0.03 0.03 0.25 0.5 600)
R89 N137 0 1k
B§Rh87 N156 N137 V=abs(I(Rh87))*(1k*abs((V(VA46)-V(gs05))/{V}))
B§Rh88 N133 N146 V=abs(I(Rh88))*(1k*abs((-V(VA46)+V(gs05))/{abs(V)}))
Dp106 N146 N145 DiodeNRD2
Dp107 N145 N156 DiodeNRD2
R90 N133 0 1k
VA47 VA47 0 PULSE(0 {V} {t2} 0.03 0.03 0.25 0.5 800)
R91 N137 0 1k
B§Rh89 N157 N137 V=abs(I(Rh89))*(1.25k*abs((V(VA47)-V(gs05))/{V}))
B§Rh90 N133 N147 V=abs(I(Rh90))*(1.25k*abs((-V(VA47)+V(gs05))/{abs(V)}))
Dp108 N147 VA47 DiodeNRD2
Dp109 VA47 N157 DiodeNRD2
R92 N133 0 1k
VA48 VA48 0 PULSE(0 {V} {t5} 0.03 0.03 0.25 0.5 200)
R93 N137 0 1k
B§Rh91 N154 N137 V=abs(I(Rh91))*(0.5k*abs((V(VA48)-V(gs05))/{V}))
B§Rh92 N133 N142 V=abs(I(Rh92))*(0.5k*abs((-V(VA48)+V(gs05))/{abs(V)}))
Dp110 N142 N141 DiodeNRD2
Dp111 N141 N154 DiodeNRD2
R94 N133 0 1k
S13 N141 VA48 gs05 0 MYSW
VA49 VA49 0 PULSE(0 {V} {t1} 0.03 0.03 0.25 0.5 1000)
R95 N137 0 1k
B§Rh93 N158 N137 V=abs(I(Rh93))*(1.5k*abs((V(VA49)-V(gs05))/{V}))
B§Rh94 N133 N148 V=abs(I(Rh94))*(1.5k*abs((-V(VA49)+V(gs05))/{abs(V)}))
Dp112 N148 VA49 DiodeNRD2
Dp113 VA49 N158 DiodeNRD2
R96 N133 0 1k
S14 N143 VA45 gs05 0 MYSW
S15 N145 VA46 gs05 0 MYSW
Vd15 ds15 0 0.5V
B§Id15 ds15 Rsw2a I=if (V(gs15)-V(T15)>V(ds15),  Km*(2*(V(gs15)-V(T15))-V(ds15))*V(ds15), (if ( V(gs15)>V(T15), Km*(V(gs15)-V(T15))*(V(gs15)-V(T15)), 0)))
C21 gs15 M15 {c1}
C22 M15 0 {c2}
Dp114 N140 gs15 DiodeNRD
Rs20 N140 N139 400Meg
Rr10 gs15 M15 29Meg
RM10 M15 0 300Meg
B§VT15 T15 0 V=VT0*(1-f*abs(V(M15))/{VT0})
Dp115 gs15 N136 DiodeNRD
Rs21 N136 N135 600Meg
VA50 VA50 0 PULSE(0 {V1} {t4} 0.03 0.03 0.25 0.5 400)
R97 N139 0 1k
B§Rh95 N160 N139 V=abs(I(Rh95))*(0.75k*abs((V(VA50)-V(gs15))/{V1}))
B§Rh96 N135 N150 V=abs(I(Rh96))*(0.75k*abs((-V(VA50)+V(gs15))/{abs(V1)}))
Dp116 N150 VA50 DiodeNRD2
Dp117 VA50 N160 DiodeNRD2
R98 N135 0 1k
VA51 VA51 0 PULSE(0 {V1} {t3} 0.03 0.03 0.25 0.5 600)
R99 N139 0 1k
B§Rh97 N161 N139 V=abs(I(Rh97))*(1k*abs((V(VA51)-V(gs15))/{V1}))
B§Rh98 N135 N151 V=abs(I(Rh98))*(1k*abs((-V(VA51)+V(gs15))/{abs(V)}))
Dp118 N151 VA51 DiodeNRD2
Dp119 VA51 N161 DiodeNRD2
R100 N135 0 1k
VA52 VA52 0 PULSE(0 {V1} {t2} 0.03 0.03 0.25 0.5 800)
R101 N139 0 1k
B§Rh99 N162 N139 V=abs(I(Rh99))*(1.25k*abs((V(VA52)-V(gs15))/{V1}))
B§Rh100 N135 N152 V=abs(I(Rh100))*(1.25k*abs((-V(VA52)+V(gs15))/{abs(V)}))
Dp120 N152 VA52 DiodeNRD2
Dp121 VA52 N162 DiodeNRD2
R102 N135 0 1k
VA53 VA53 0 PULSE(0 {V1} {t5} 0.03 0.03 0.25 0.5 200)
R103 N139 0 1k
B§Rh101 N159 N139 V=abs(I(Rh101))*(0.5k*abs((V(VA53)-V(gs15))/{V1}))
B§Rh102 N135 N149 V=abs(I(Rh102))*(0.5k*abs((-V(VA53)+V(gs15))/{abs(V)}))
Dp122 N149 VA53 DiodeNRD2
Dp123 VA53 N159 DiodeNRD2
R104 N135 0 1k
VA54 VA54 0 PULSE(0 {V1} {t1} 0.03 0.03 0.25 0.5 1000)
R105 N139 0 1k
B§Rh103 N163 N139 V=abs(I(Rh103))*(1.5k*abs((V(VA54)-V(gs15))/{V1}))
B§Rh104 N135 N153 V=abs(I(Rh104))*(1.5k*abs((-V(VA54)+V(gs15))/{abs(V)}))
Dp124 N153 VA54 DiodeNRD2
Dp125 VA54 N163 DiodeNRD2
R106 N135 0 1k
Vd06 ds06 0 0.5V
B§Id3 ds06 Rsw1a I=if (V(gs06)-V(T06)>V(ds06),  Km*(2*(V(gs06)-V(T06))-V(ds06))*V(ds06), (if ( V(gs06)>V(T06), Km*(V(gs06)-V(T06))*(V(gs06)-V(T06)), 0)))
C23 gs06 M06 {c1}
C24 M06 0 {c2}
Dp126 N169 gs06 DiodeNRD
Rs22 N169 N168 400Meg
Rr11 gs06 M06 29Meg
RM11 M06 0 300Meg
B§VT06 T06 0 V=VT0*(1-f*abs(V(M06))/{VT0})
Dp127 gs06 N165 DiodeNRD
Rs23 N165 N164 600Meg
VA55 VA55 0 PULSE(0 {V} {t4} 0.03 0.03 0.25 0.5 400)
R107 N168 0 1k
B§Rh105 N186 N168 V=abs(I(Rh105))*(0.75k*abs((V(VA55)-V(gs06))/{V}))
B§Rh106 N164 N175 V=abs(I(Rh106))*(0.75k*abs((-V(VA55)+V(gs06))/{abs(V)}))
Dp128 N175 N174 DiodeNRD2
Dp129 N174 N186 DiodeNRD2
R108 N164 0 1k
VA56 VA56 0 PULSE(0 {V} {t3} 0.03 0.03 0.25 0.5 600)
R109 N168 0 1k
B§Rh107 N187 N168 V=abs(I(Rh107))*(1k*abs((V(VA56)-V(gs06))/{V}))
B§Rh108 N164 N177 V=abs(I(Rh108))*(1k*abs((-V(VA56)+V(gs06))/{abs(V)}))
Dp130 N177 N176 DiodeNRD2
Dp131 N176 N187 DiodeNRD2
R110 N164 0 1k
VA57 VA57 0 PULSE(0 {V} {t2} 0.03 0.03 0.25 0.5 800)
R111 N168 0 1k
B§Rh109 N188 N168 V=abs(I(Rh109))*(1.25k*abs((V(VA57)-V(gs06))/{V}))
B§Rh110 N164 N178 V=abs(I(Rh110))*(1.25k*abs((-V(VA57)+V(gs06))/{abs(V)}))
Dp132 N178 VA57 DiodeNRD2
Dp133 VA57 N188 DiodeNRD2
R112 N164 0 1k
VA58 VA58 0 PULSE(0 {V} {t5} 0.03 0.03 0.25 0.5 200)
R113 N168 0 1k
B§Rh111 N185 N168 V=abs(I(Rh111))*(0.5k*abs((V(VA58)-V(gs06))/{V}))
B§Rh112 N164 N173 V=abs(I(Rh112))*(0.5k*abs((-V(VA58)+V(gs06))/{abs(V)}))
Dp134 N173 N172 DiodeNRD2
Dp135 N172 N185 DiodeNRD2
R114 N164 0 1k
S16 N172 VA58 gs06 0 MYSW
VA59 VA59 0 PULSE(0 {V} {t1} 0.03 0.03 0.25 0.5 1000)
R115 N168 0 1k
B§Rh113 N189 N168 V=abs(I(Rh113))*(1.5k*abs((V(VA59)-V(gs06))/{V}))
B§Rh114 N164 N179 V=abs(I(Rh114))*(1.5k*abs((-V(VA59)+V(gs06))/{abs(V)}))
Dp136 N179 VA59 DiodeNRD2
Dp137 VA59 N189 DiodeNRD2
R116 N164 0 1k
S17 N174 VA55 gs06 0 MYSW
S18 N176 VA56 gs06 0 MYSW
Vd16 ds16 0 0.5V
B§Id16 ds16 Rsw2a I=if (V(gs16)-V(T16)>V(ds16),  Km*(2*(V(gs16)-V(T16))-V(ds16))*V(ds16), (if ( V(gs16)>V(T16), Km*(V(gs16)-V(T16))*(V(gs16)-V(T16)), 0)))
C25 gs16 M16 {c1}
C26 M16 0 {c2}
Dp138 N171 gs16 DiodeNRD
Rs24 N171 N170 400Meg
Rr12 gs16 M16 29Meg
RM12 M16 0 300Meg
B§VT16 T16 0 V=VT0*(1-f*abs(V(M16))/{VT0})
Dp139 gs16 N167 DiodeNRD
Rs25 N167 N166 600Meg
VA60 VA60 0 PULSE(0 {V1} {t4} 0.03 0.03 0.25 0.5 400)
R117 N170 0 1k
B§Rh115 N191 N170 V=abs(I(Rh115))*(0.75k*abs((V(VA60)-V(gs16))/{V1}))
B§Rh116 N166 N181 V=abs(I(Rh116))*(0.75k*abs((-V(VA60)+V(gs16))/{abs(V1)}))
Dp140 N181 VA60 DiodeNRD2
Dp141 VA60 N191 DiodeNRD2
R118 N166 0 1k
VA61 VA61 0 PULSE(0 {V1} {t3} 0.03 0.03 0.25 0.5 600)
R119 N170 0 1k
B§Rh117 N192 N170 V=abs(I(Rh117))*(1k*abs((V(VA61)-V(gs16))/{V1}))
B§Rh118 N166 N182 V=abs(I(Rh118))*(1k*abs((-V(VA61)+V(gs16))/{abs(V)}))
Dp142 N182 VA61 DiodeNRD2
Dp143 VA61 N192 DiodeNRD2
R120 N166 0 1k
VA62 VA62 0 PULSE(0 {V1} {t2} 0.03 0.03 0.25 0.5 800)
R121 N170 0 1k
B§Rh119 N193 N170 V=abs(I(Rh119))*(1.25k*abs((V(VA62)-V(gs16))/{V1}))
B§Rh120 N166 N183 V=abs(I(Rh120))*(1.25k*abs((-V(VA62)+V(gs16))/{abs(V)}))
Dp144 N183 VA62 DiodeNRD2
Dp145 VA62 N193 DiodeNRD2
R122 N166 0 1k
VA63 VA63 0 PULSE(0 {V1} {t5} 0.03 0.03 0.25 0.5 200)
R123 N170 0 1k
B§Rh121 N190 N170 V=abs(I(Rh121))*(0.5k*abs((V(VA63)-V(gs16))/{V1}))
B§Rh122 N166 N180 V=abs(I(Rh122))*(0.5k*abs((-V(VA63)+V(gs16))/{abs(V)}))
Dp146 N180 VA63 DiodeNRD2
Dp147 VA63 N190 DiodeNRD2
R124 N166 0 1k
VA64 VA64 0 PULSE(0 {V1} {t1} 0.03 0.03 0.25 0.5 1000)
R125 N170 0 1k
B§Rh123 N194 N170 V=abs(I(Rh123))*(1.5k*abs((V(VA64)-V(gs16))/{V1}))
B§Rh124 N166 N184 V=abs(I(Rh124))*(1.5k*abs((-V(VA64)+V(gs16))/{abs(V)}))
Dp148 N184 VA64 DiodeNRD2
Dp149 VA64 N194 DiodeNRD2
R126 N166 0 1k
Vd07 ds07 0 0.5V
B§Id07 ds07 Rsw1a I=if (V(gs07)-V(T07)>V(ds07),  Km*(2*(V(gs07)-V(T07))-V(ds07))*V(ds07), (if ( V(gs07)>V(T07), Km*(V(gs07)-V(T07))*(V(gs07)-V(T07)), 0)))
C27 gs07 M07 {c1}
C28 M07 0 {c2}
Dp150 N200 gs07 DiodeNRD
Rs26 N200 N199 400Meg
Rr13 gs07 M07 29Meg
RM13 M07 0 300Meg
B§VT07 T07 0 V=VT0*(1-f*abs(V(M07))/{VT0})
Dp151 gs07 N196 DiodeNRD
Rs27 N196 N195 600Meg
VA65 VA65 0 PULSE(0 {V} {t4} 0.03 0.03 0.25 0.5 400)
R127 N199 0 1k
B§Rh125 N217 N199 V=abs(I(Rh125))*(0.75k*abs((V(VA65)-V(gs07))/{V}))
B§Rh126 N195 N206 V=abs(I(Rh126))*(0.75k*abs((-V(VA65)+V(gs07))/{abs(V)}))
Dp152 N206 N205 DiodeNRD2
Dp153 N205 N217 DiodeNRD2
R128 N195 0 1k
VA66 VA66 0 PULSE(0 {V} {t3} 0.03 0.03 0.25 0.5 600)
R129 N199 0 1k
B§Rh127 N218 N199 V=abs(I(Rh127))*(1k*abs((V(VA66)-V(gs07))/{V}))
B§Rh128 N195 N208 V=abs(I(Rh128))*(1k*abs((-V(VA66)+V(gs07))/{abs(V)}))
Dp154 N208 N207 DiodeNRD2
Dp155 N207 N218 DiodeNRD2
R130 N195 0 1k
VA67 VA67 0 PULSE(0 {V} {t2} 0.03 0.03 0.25 0.5 800)
R131 N199 0 1k
B§Rh129 N219 N199 V=abs(I(Rh129))*(1.25k*abs((V(VA67)-V(gs07))/{V}))
B§Rh130 N195 N209 V=abs(I(Rh130))*(1.25k*abs((-V(VA67)+V(gs07))/{abs(V)}))
Dp156 N209 VA67 DiodeNRD2
Dp157 VA67 N219 DiodeNRD2
R132 N195 0 1k
VA68 VA68 0 PULSE(0 {V} {t5} 0.03 0.03 0.25 0.5 200)
R133 N199 0 1k
B§Rh131 N216 N199 V=abs(I(Rh131))*(0.5k*abs((V(VA68)-V(gs07))/{V}))
B§Rh132 N195 N204 V=abs(I(Rh132))*(0.5k*abs((-V(VA68)+V(gs07))/{abs(V)}))
Dp158 N204 N203 DiodeNRD2
Dp159 N203 N216 DiodeNRD2
R134 N195 0 1k
S19 N203 VA68 gs07 0 MYSW
VA69 VA69 0 PULSE(0 {V} {t1} 0.03 0.03 0.25 0.5 1000)
R135 N199 0 1k
B§Rh133 N220 N199 V=abs(I(Rh133))*(1.5k*abs((V(VA69)-V(gs07))/{V}))
B§Rh134 N195 N210 V=abs(I(Rh134))*(1.5k*abs((-V(VA69)+V(gs07))/{abs(V)}))
Dp160 N210 VA69 DiodeNRD2
Dp161 VA69 N220 DiodeNRD2
R136 N195 0 1k
S20 N205 VA65 gs07 0 MYSW
S21 N207 VA66 gs07 0 MYSW
Vd17 ds17 0 0.5V
B§Id17 ds17 Rsw2a I=if (V(gs17)-V(T17)>V(ds17),  Km*(2*(V(gs17)-V(T17))-V(ds17))*V(ds17), (if ( V(gs17)>V(T17), Km*(V(gs17)-V(T17))*(V(gs17)-V(T17)), 0)))
C29 gs17 M17 {c1}
C30 M17 0 {c2}
Dp162 N202 gs17 DiodeNRD
Rs28 N202 N201 400Meg
Rr14 gs17 M17 29Meg
RM14 M17 0 300Meg
B§VT17 T17 0 V=VT0*(1-f*abs(V(M17))/{VT0})
Dp163 gs17 N198 DiodeNRD
Rs29 N198 N197 600Meg
VA70 VA70 0 PULSE(0 {V1} {t4} 0.03 0.03 0.25 0.5 400)
R137 N201 0 1k
B§Rh135 N222 N201 V=abs(I(Rh135))*(0.75k*abs((V(VA70)-V(gs17))/{V1}))
B§Rh136 N197 N212 V=abs(I(Rh136))*(0.75k*abs((-V(VA70)+V(gs17))/{abs(V1)}))
Dp164 N212 VA70 DiodeNRD2
Dp165 VA70 N222 DiodeNRD2
R138 N197 0 1k
VA71 VA71 0 PULSE(0 {V1} {t3} 0.03 0.03 0.25 0.5 600)
R139 N201 0 1k
B§Rh137 N223 N201 V=abs(I(Rh137))*(1k*abs((V(VA71)-V(gs17))/{V1}))
B§Rh138 N197 N213 V=abs(I(Rh138))*(1k*abs((-V(VA71)+V(gs17))/{abs(V)}))
Dp166 N213 VA71 DiodeNRD2
Dp167 VA71 N223 DiodeNRD2
R140 N197 0 1k
VA72 VA72 0 PULSE(0 {V1} {t2} 0.03 0.03 0.25 0.5 800)
R141 N201 0 1k
B§Rh139 N224 N201 V=abs(I(Rh139))*(1.25k*abs((V(VA72)-V(gs17))/{V1}))
B§Rh140 N197 N214 V=abs(I(Rh140))*(1.25k*abs((-V(VA72)+V(gs17))/{abs(V)}))
Dp168 N214 VA72 DiodeNRD2
Dp169 VA72 N224 DiodeNRD2
R142 N197 0 1k
VA73 VA73 0 PULSE(0 {V1} {t5} 0.03 0.03 0.25 0.5 200)
R143 N201 0 1k
B§Rh141 N221 N201 V=abs(I(Rh141))*(0.5k*abs((V(VA73)-V(gs17))/{V1}))
B§Rh142 N197 N211 V=abs(I(Rh142))*(0.5k*abs((-V(VA73)+V(gs17))/{abs(V)}))
Dp170 N211 VA73 DiodeNRD2
Dp171 VA73 N221 DiodeNRD2
R144 N197 0 1k
VA74 VA74 0 PULSE(0 {V1} {t1} 0.03 0.03 0.25 0.5 1000)
R145 N201 0 1k
B§Rh143 N225 N201 V=abs(I(Rh143))*(1.5k*abs((V(VA74)-V(gs17))/{V1}))
B§Rh144 N197 N215 V=abs(I(Rh144))*(1.5k*abs((-V(VA74)+V(gs17))/{abs(V)}))
Dp172 N215 VA74 DiodeNRD2
Dp173 VA74 N225 DiodeNRD2
R146 N197 0 1k
Vd08 ds08 0 0.5V
B§Id08 ds08 Rsw1a I=if (V(gs08)-V(T08)>V(ds08),  Km*(2*(V(gs08)-V(T08))-V(ds08))*V(ds08), (if ( V(gs08)>V(T08), Km*(V(gs08)-V(T08))*(V(gs08)-V(T08)), 0)))
C31 gs08 M08 {c1}
C32 M08 0 {c2}
Dp174 N231 gs08 DiodeNRD
Rs30 N231 N230 400Meg
Rr15 gs08 M08 29Meg
RM15 M08 0 300Meg
B§VT08 T08 0 V=VT0*(1-f*abs(V(M08))/{VT0})
Dp175 gs08 N227 DiodeNRD
Rs31 N227 N226 600Meg
VA75 VA75 0 PULSE(0 {V} {t4} 0.03 0.03 0.25 0.5 400)
R147 N230 0 1k
B§Rh145 N248 N230 V=abs(I(Rh145))*(0.75k*abs((V(VA75)-V(gs08))/{V}))
B§Rh146 N226 N237 V=abs(I(Rh146))*(0.75k*abs((-V(VA75)+V(gs08))/{abs(V)}))
Dp176 N237 N236 DiodeNRD2
Dp177 N236 N248 DiodeNRD2
R148 N226 0 1k
VA76 VA76 0 PULSE(0 {V} {t3} 0.03 0.03 0.25 0.5 600)
R149 N230 0 1k
B§Rh147 N249 N230 V=abs(I(Rh147))*(1k*abs((V(VA76)-V(gs08))/{V}))
B§Rh148 N226 N239 V=abs(I(Rh148))*(1k*abs((-V(VA67)+V(gs08))/{abs(V)}))
Dp178 N239 N238 DiodeNRD2
Dp179 N238 N249 DiodeNRD2
R150 N226 0 1k
VA77 VA77 0 PULSE(0 {V} {t2} 0.03 0.03 0.25 0.5 800)
R151 N230 0 1k
B§Rh149 N250 N230 V=abs(I(Rh149))*(1.25k*abs((V(VA77)-V(gs08))/{V}))
B§Rh150 N226 N240 V=abs(I(Rh150))*(1.25k*abs((-V(VA77)+V(gs08))/{abs(V)}))
Dp180 N240 VA77 DiodeNRD2
Dp181 VA77 N250 DiodeNRD2
R152 N226 0 1k
VA78 VA78 0 PULSE(0 {V} {t5} 0.03 0.03 0.25 0.5 200)
R153 N230 0 1k
B§Rh151 N247 N230 V=abs(I(Rh151))*(0.5k*abs((V(VA78)-V(gs08))/{V}))
B§Rh152 N226 N235 V=abs(I(Rh152))*(0.5k*abs((-V(VA78)+V(gs08))/{abs(V)}))
Dp182 N235 N234 DiodeNRD2
Dp183 N234 N247 DiodeNRD2
R154 N226 0 1k
S22 N234 VA78 gs08 0 MYSW
VA79 VA79 0 PULSE(0 {V} {t1} 0.03 0.03 0.25 0.5 1000)
R155 N230 0 1k
B§Rh153 N251 N230 V=abs(I(Rh153))*(1.5k*abs((V(VA79)-V(gs08))/{V}))
B§Rh154 N226 N241 V=abs(I(Rh154))*(1.5k*abs((-V(VA79)+V(gs08))/{abs(V)}))
Dp184 N241 VA79 DiodeNRD2
Dp185 VA79 N251 DiodeNRD2
R156 N226 0 1k
S23 N236 VA75 gs08 0 MYSW
S24 N238 VA76 gs08 0 MYSW
Vd18 ds18 0 0.5V
B§Id18 ds18 Rsw2a I=if (V(gs18)-V(T18)>V(ds18),  Km*(2*(V(gs18)-V(T18))-V(ds18))*V(ds18), (if ( V(gs18)>V(T18), Km*(V(gs18)-V(T18))*(V(gs18)-V(T18)), 0)))
C33 gs18 M18 {c1}
C34 M18 0 {c2}
Dp186 N233 gs18 DiodeNRD
Rs32 N233 N232 400Meg
Rr16 gs18 M18 29Meg
RM16 M18 0 300Meg
B§VT18 T18 0 V=VT0*(1-f*abs(V(M18))/{VT0})
Dp187 gs18 N229 DiodeNRD
Rs33 N229 N228 600Meg
VA80 VA80 0 PULSE(0 {V1} {t4} 0.03 0.03 0.25 0.5 400)
R157 N232 0 1k
B§Rh155 N253 N232 V=abs(I(Rh155))*(0.75k*abs((V(VA80)-V(gs18))/{V1}))
B§Rh156 N228 N243 V=abs(I(Rh156))*(0.75k*abs((-V(VA80)+V(gs18))/{abs(V1)}))
Dp188 N243 VA80 DiodeNRD2
Dp189 VA80 N253 DiodeNRD2
R158 N228 0 1k
VA81 VA81 0 PULSE(0 {V1} {t3} 0.03 0.03 0.25 0.5 600)
R159 N232 0 1k
B§Rh157 N254 N232 V=abs(I(Rh157))*(1k*abs((V(VA81)-V(gs18))/{V1}))
B§Rh158 N228 N244 V=abs(I(Rh158))*(1k*abs((-V(VA81)+V(gs18))/{abs(V)}))
Dp190 N244 VA81 DiodeNRD2
Dp191 VA81 N254 DiodeNRD2
R160 N228 0 1k
VA82 VA82 0 PULSE(0 {V1} {t2} 0.03 0.03 0.25 0.5 800)
R161 N232 0 1k
B§Rh159 N255 N232 V=abs(I(Rh159))*(1.25k*abs((V(VA82)-V(gs18))/{V1}))
B§Rh160 N228 N245 V=abs(I(Rh160))*(1.25k*abs((-V(VA82)+V(gs18))/{abs(V)}))
Dp192 N245 VA82 DiodeNRD2
Dp193 VA82 N255 DiodeNRD2
R162 N228 0 1k
VA83 VA83 0 PULSE(0 {V1} {t5} 0.03 0.03 0.25 0.5 200)
R163 N232 0 1k
B§Rh161 N252 N232 V=abs(I(Rh161))*(0.5k*abs((V(VA83)-V(gs18))/{V1}))
B§Rh162 N228 N242 V=abs(I(Rh162))*(0.5k*abs((-V(VA83)+V(gs18))/{abs(V)}))
Dp194 N242 VA83 DiodeNRD2
Dp195 VA83 N252 DiodeNRD2
R164 N228 0 1k
VA84 VA84 0 PULSE(0 {V1} {t1} 0.03 0.03 0.25 0.5 1000)
R165 N232 0 1k
B§Rh163 N256 N232 V=abs(I(Rh163))*(1.5k*abs((V(VA84)-V(gs18))/{V1}))
B§Rh164 N228 N246 V=abs(I(Rh164))*(1.5k*abs((-V(VA84)+V(gs18))/{abs(V)}))
Dp196 N246 VA84 DiodeNRD2
Dp197 VA84 N256 DiodeNRD2
R166 N228 0 1k
.model D D
.lib standard.dio
.tran 600
.param Vr=-6 V=9 V1=9 V2=9
.model DiodeNRD D (Ron=.1 Roff=100T Vfwd=0.3)
.params W=50e-9 L=8e-6 d= 30e-9 mun=0.08 lambda=0.03
.param VT0=0.28V
.param cgsm=c1*c2/(c1+c2)  Km=(1/2)*8*(W/L)*mun*cgsm/(L*L)
.param f=.1
.params c1=0.0000009u c2=.7u
.model DiodeNRD2 D (Ron=.1 Roff=100T Vfwd=0)
.model MYSW SW(Ron=1 Roff=100Meg Vt=0.5 Vh=0)
* SOMA
.model MCSW CSW(Ron=0.1 Roff=1000Meg It=32u Ih=0)
VIN1 Rsw1a Rsw1b 0
VIN2 Rsw2a Rsw2b 0
* Nclose
* Nfar'
* Nfar
* SOMA
.param t1=0 t2=100 t3=200 t4=300 t5=400
* a5
* a4
* a3
* a2
* a1
* a5
* a4
* a3
* a2
* a1
VIN3 Rsw3a Rsw3b 0
* B5
* B4
* B3
* B2
* B1
* SOMA
* B5
* B4
* B3
* B2
* B1
.model MCSW1 CSW(Ron=0.1 Roff=1000Meg It=3u Ih=0)
* c5
* c4
* c3
* c2
* c1
* SOMA
* c5
* c4
* c3
* c2
* c1
* d5
* d4
* d3
* d2
* d1
* SOMA
* d5
* d4
* d3
* d2
* d1
* e5
* e4
* e3
* e2
* e1
* SOMA
* e5
* e4
* e3
* e2
* e1
* f5
* f4
* f3
* f2
* f1
* SOMA
* f5
* f4
* f3
* f2
* f1
* g5
* g4
* g3
* g2
* g1
* SOMA
* g5
* g4
* g3
* g2
* g1
* h5
* h4
* h3
* h2
* h1
* SOMA
* h5
* h4
* h3
* h2
* h1
* Last update: 2024. 06. 06.
* This circuit has been developed by Dr. Eunhye Baek.
* Transistor Vth,0
* sol-gel film parameters
* Transistor device parameters
* Input pulse ampitudes
* synaptic input start time
* volgtage-dependent switch
* IDS,Nclose
* IDS,Nfar'
* current-dependent switch
* VNclose
* Inhibitory synapse
* VNfar
* IDS,Nfar
* Silent synapse
.backanno
.end